# Altium schematic sheet STPedal_Peripherals.SchDoc
size A4; SheetNumber: 4; SheetTotal: 4
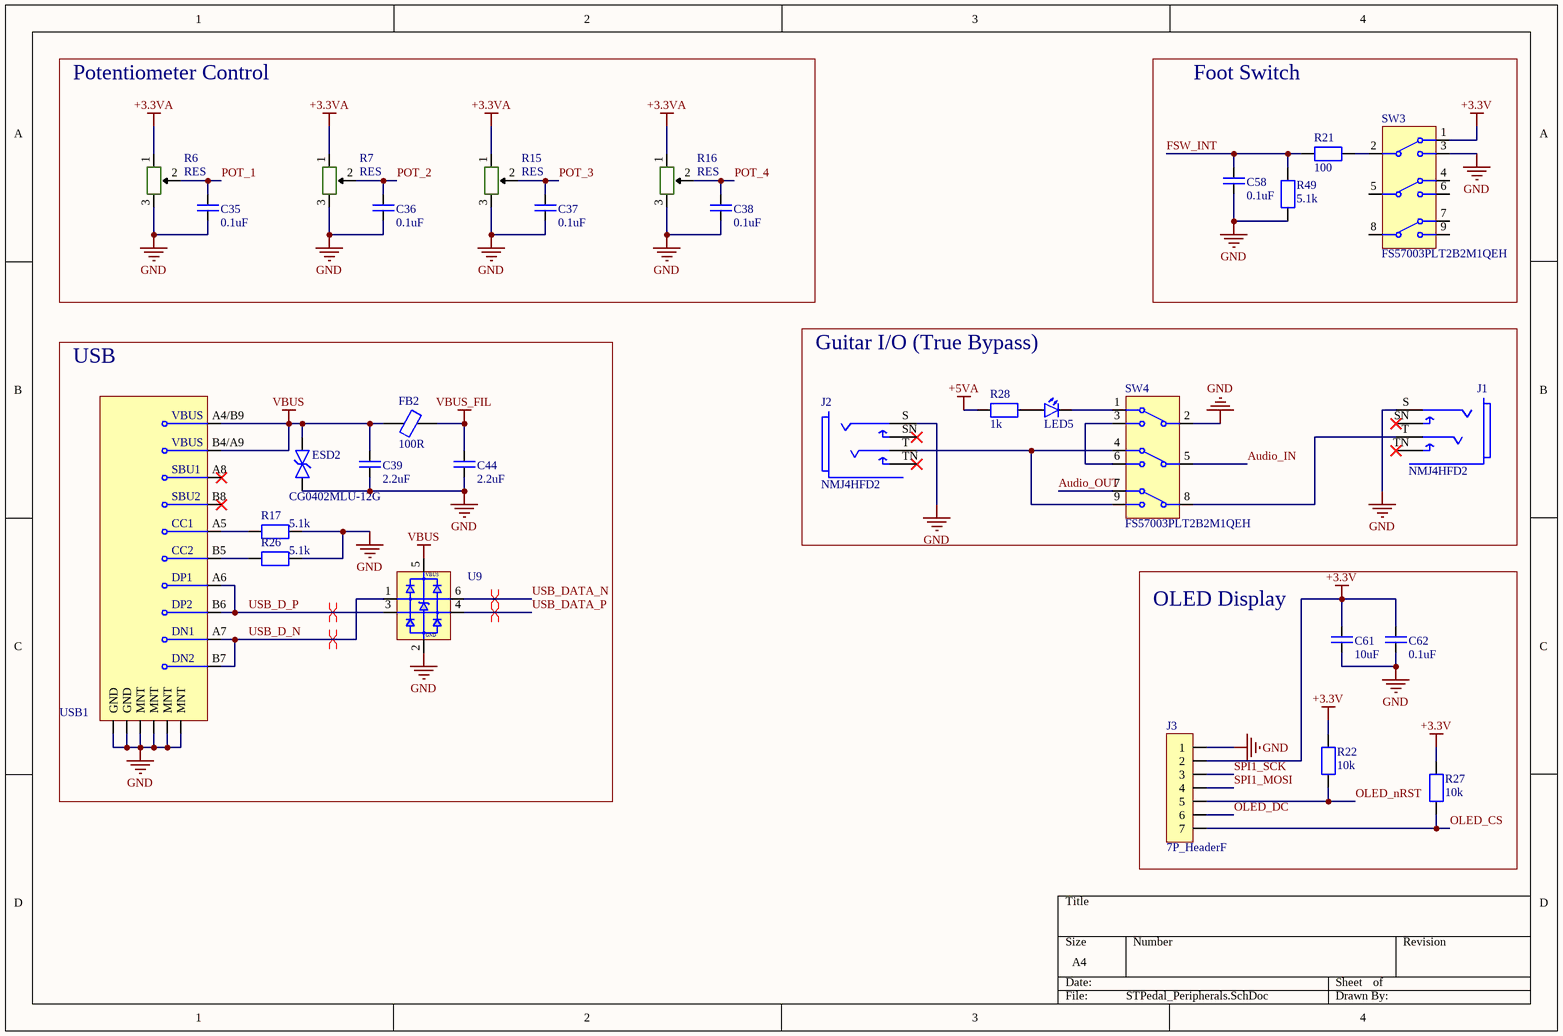
[diagram p0: STPedal_Peripherals.SchDoc]

## Parts
C35  0.1uF  [CAPC_0402_1005X55N]
C36  0.1uF  [CAPC_0402_1005X55N]
C37  0.1uF  [CAPC_0402_1005X55N]
C38  0.1uF  [CAPC_0402_1005X55N]
C39  2.2uF  [CAPC_0402_1005X55N]
C44  2.2uF  [CAPC_0402_1005X55N]
C58  0.1uF  [CAPC_0402_1005X55N]
C61  10uF  [RESC_0603_1608X55N]
C62  0.1uF  [CAPC_0402_1005X55N]
ESD2  CG0402MLU-12G  [DIOC_0402_1005X41N]
FB2  100R  [FBC_0805_2012X105N]
J1  NMJ4HFD2  [FP-NMJ4HFD2-MFG]  (no BOM)
J2  NMJ4HFD2  [FP-NMJ4HFD2-MFG]  (no BOM)
J3  7P_HeaderF  [7P_2.54]  (no BOM)
LED5  LED_5mm_THT  [LED_THT_5mm]  (value not drawn)  (no BOM)
R6  RES  [PTV09A-4020S-B104]  (no BOM)
R7  RES  [PTV09A-4020S-B104]  (no BOM)
R15  RES  [PTV09A-4020S-B104]  (no BOM)
R16  RES  [PTV09A-4020S-B104]  (no BOM)
R17  5.1k  [RESC_0402_1005X40N]
R21  100  [RESC_0402_1005X40N]
R22  10k  [RESC_0402_1005X40N]
R26  5.1k  [RESC_0402_1005X40N]
R27  10k  [RESC_0402_1005X40N]
R28  1k  [RESC_0402_1005X40N]
R49  5.1k  [RESC_0402_1005X40N]
SW3  FS57003PLT2B2M1QEH  [3PDT_FootSwitch]  (no BOM)
SW4  FS57003PLT2B2M1QEH  [3PDT_FootSwitch]  (no BOM)
U9  USBLC6-2SC6_JLC  [SOT23-6L]  (value not drawn)
USB1  USB_C_JLC_16P  [USB_C_SMT_16P]  (value not drawn)

## Blocks framed on the sheet
Potentiometer Control: C35-C38 R6 R7 R15 R16
Foot Switch: C58 R21 R49 SW3
USB: C39 C44 ESD2 FB2 R17 R26 U9 USB1
Guitar I/O (True Bypass): J1 J2 LED5 R28 SW4
OLED Display: C61 C62 J3 R22 R27

## Nets
+3.3V: C61.2 C62.2 J3.2 R22.2 R27.2 SW3.1
+3.3VA: R6.1 R7.1 R15.1 R16.1
+5VA: R28.1
GND: C35.1 C36.1 C37.1 C38.1 C39.1 C44.1 C58.1 C61.1 C62.1 ESD2.1 J1.S J2.S J3.1 R6.3 R7.3 R15.3 R16.3 R17.2 R26.2 R49.1 SW3.3 SW4.2 U9.2 USB1.A1/B12(GND) USB1.B1/A12(GND) USB1.MNT1(MNT) USB1.MNT2(MNT) USB1.MNT3(MNT) USB1.MNT4(MNT)
VBUS: C39.2 ESD2.2 FB2.1 U9.5 USB1.A4/B9(VBUS) USB1.B4/A9(VBUS)
VBUS_FIL: C44.2 FB2.2
Audio_IN: SW4.5
Audio_OUT: SW4.7
FSW_INT: C58.2 R21.1 R49.2
OLED_CS: J3.7 R27.1
OLED_DC: J3.6
OLED_nRST: J3.5 R22.1
POT_1: C35.2 R6.2
POT_2: C36.2 R7.2
POT_3: C37.2 R15.2
POT_4: C38.2 R16.2
SPI1_MOSI: J3.4
SPI1_SCK: J3.3
USB_D_N: U9.1 USB1.A7(DN1) USB1.B7(DN2)
USB_D_P: U9.3 USB1.A6(DP1) USB1.B6(DP2)
USB_DATA_N: U9.6
USB_DATA_P: U9.4
NetJ1_T: J1.T SW4.8
NetJ2_T: J2.T SW4.4 SW4.9
NetLED5_1: LED5.1 R28.2
NetLED5_2: LED5.2 SW4.1
NetR17_1: R17.1 USB1.A5(CC1)
NetR21_2: R21.2 SW3.2
NetR26_1: R26.1 USB1.B5(CC2)
NetSW4_3: SW4.3 SW4.6

Not connected (* = marked no-connect by the designer): J1 SN* TN*; J2 SN* TN*; SW3 4 5 6 7 8 9; USB1 A8(SBU1)* B8(SBU2)*

## Layout directives
differential pair: USB_D_N, USB_D_P, USB_DATA_N, USB_DATA_P

## Notes on the sheet
- (in symbol USBLC6-2SC6_JLC) VBUS; GND

## Library data of the parts
C35-C38 C58 C62 = 0.1uF_CAP_0402: Capacitor 0402 - 0.1uF +-/10% / 16V; Manufacturer: Samsung Electro-Mechanics; MPN: CL05B104KO5NNNC; LCSC: C1525
C39 C44 = 2.2uF_CAP_0402: Capacitor 0402 - 2.2uF +-/10% / 25V; Manufacturer: Samsung Electro-Mechanics; MPN: CL05A225MQ5NSNC; LCSC: C12530
C61 = 10uF_CAP_0603: Capacitor 0603 - 0.1uF +-/10% / 25V; Manufacturer: Samsung Electro-Mechanics; MPN: CL10A106MA8NRNC; LCSC: C96446
ESD2 = CG0402MLU-12G: -40℃~+125℃ 0.05pF 1 12V 25V 5nA ESD IEC 61000-4-2 0402 ESD and Surge Protection (TVS/ESD) ROHS; Manufacturer: BOURNS; MPN: CG0402MLU-12G; LCSC: C2655716
FB2 = 100@100MHz_JLCFB_0805: -55℃~+155℃ 5.1kΩ 50V 62.5mW Thick Film Resistor ±1% ±100ppm/℃ 0402 Chip Resistor - Surface Mount ROHS; Manufacturer: Sunlord; MPN: GZ2012D101TF; LCSC: C1015
J1 J2 = CMP-78736-000001-1: Conn 1/4" Mono Jack F 3 POS Solder RA Thru-Hole 3 Terminal 1 Port; Manufacturer: Neutrik; Number Of Contacts: 2; Current Rating: 0.5A; Voltage Rating: 50V; Conn Orientation: Horizontal; Is Female: yes; Temperature: -25°C to +70°C; ComponentLink2Description: Datasheet; ComponentLink2URL: https://www.neutrik.com/en/product/nmj4hfd2.pdf; Contact Material: Silver; Height: 15.89mm; Package: 0; Mouser Description: Phone Audio Connector, Socket, 2, PCB Mount, Metal Body, Silver Plated Contacts; Manufacturer Part Number: NMJ4HFD2; Automotive: No; RoHS: TRUE; Lead Free: Yes; Device Class L2: Audio / Video Connectors; Device Class L3: unset; Temperature Range Low: -25°C; Category: Conn; Footprint Url: https://www.neutrik.com/media/8576/download/st-nmj4hfd2.pdf?v=1; Temperature Range High: +70°C; Device Class L1: Connectors; Octopart: https://octopart.com/nmj4hfd2-neutrik-758952
J3 = 7P_FemaleHeader_2.54mm
LED5 = LED_5mm_THT: Generic THT 5mm led
R6 R7 R15 R16 = POT_Gen_5mm: Generic Potentiometer 5mm pitch; Manufacturer: *; MPN: *; LCSC: *
R17 R26 R49 = 5.1k_JLCRES-0402: -55℃~+155℃ 5.1kΩ 50V 62.5mW Thick Film Resistor ±1% ±100ppm/℃ 0402 Chip Resistor - Surface Mount ROHS; Manufacturer: UNI-ROYAL(Uniroyal Elec); MPN: 0402WGF5101TCE; LCSC: C25905
R21 = 100R_JLCRES-0402: Resistor 0402 - 100R; Manufacturer: *; MPN: *; LCSC: C25076
R22 R27 = 10k_JLCRES-0402: -55℃~+155℃ 10kΩ 50V 62.5mW Thick Film Resistor ±1% ±100ppm/℃ 0402 Chip Resistor - Surface Mount ROHS; Manufacturer: UNI-ROYAL(Uniroyal Elec); MPN: 0402WGF1002TCE; LCSC: C25744
R28 = 1k_JLCRES-0402: Resistor 0402 - 1k; Manufacturer: UNI-ROYAL(Uniroyal Elec); MPN: 0402WGF1001TCE; LCSC: C11702
SW3 SW4 = FS57003PLT2B2M1QEH_FootSwitch_3PDT: SWITCH PUSHBUTTON 3PDT 1A 9V; Manufacturer: E-Switch; MPN: FS57003PLT2B2M1QEH; LCSC: C3315866; ComponentLink1Description: Digikey; ComponentLink1URL: https://www.digikey.co.nz/en/products/detail/e-switch/FS57003PLT2B2M1QEH/6825399?gclsrc=aw.ds&gad_source=1&gad_campaignid=17419957627&gbraid=0AAAAADrbLli30KpXhhNcZ1xqLjHYd0W2W&gclid=CjwKCAjwl97RBhBWEiwAa9rbXUauQOGKi4iSMkdk9_Y1NkU4OmdcWE9QqEc_UI5nVm6lPQILuOQigBoCCyUQAvD_BwE
U9 = USBLC6-2SC6_JLC: -40℃~+125℃ 150nA 17V 2 3.5pF 5.25V 5A 6V ESD IEC 61000-4-2 Unidirectional SOT-23-6L ESD and Surge Protection (TVS/ESD) ROHS; Manufacturer: STMicroelectronics; MPN: USBLC6-2SC6; LCSC: C7519
USB1 = USB_C_JLC_16P: -30℃~+80℃ 1 10,000 cycles 16P 20V 5A 7.35mm Female Surface Mount, Right Angle Type-C SMD USB Connectors ROHS; Manufacturer: Korean Hroparts Elec; MPN: TYPE-C-31-M-12; LCSC: C165948